# Altium project LANDING-STATIONnoCTRL.PrjPcb
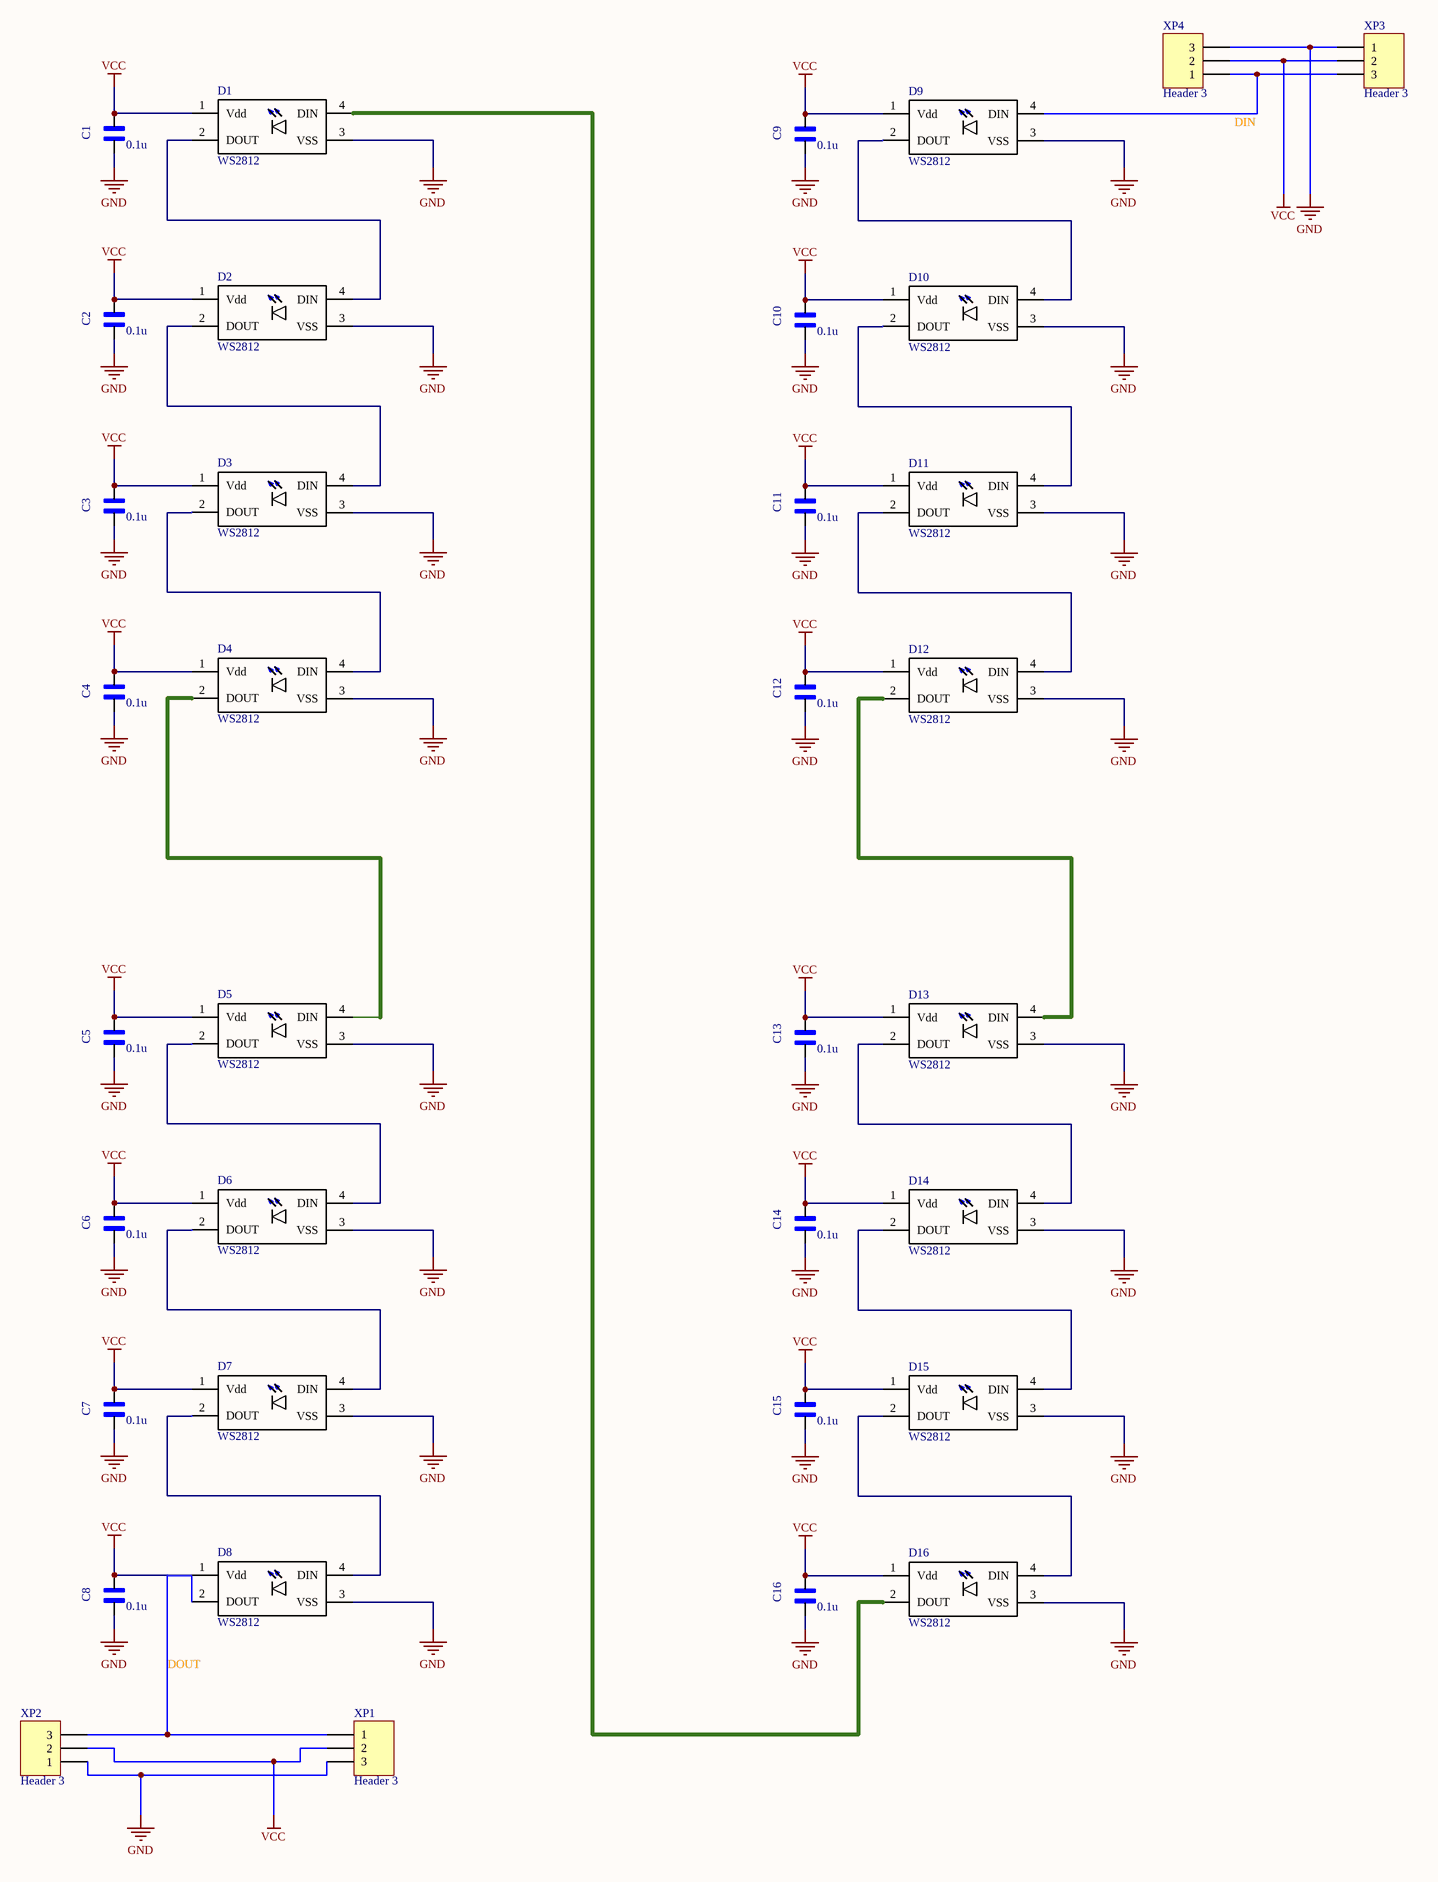
[diagram p0: LANDING-STATION-SCHnoCTRL.SchDoc]
Designer: Ehsan Shaghaei; Version: 1.0
1 sheet, 36 parts. Net scope: global (net labels, ports and power ports of the same name join across sheets).
Board file: LANDING-STATION-PCBnoCTRL.PcbDoc

## Sheet LANDING-STATION-SCHnoCTRL.SchDoc
size D; Author: Ehsan Shaghaei; CompanyName: Innopolis; Engineer: Ehsan Shaghaei; Organization: Innopolis Unmanned Tech. Labs; SheetNumber: 1; SheetTotal: 1

### Parts
C1  value 0.1u  [*CAPC1608X90]  (hidden comment: GX035C104MAT2-500)
C2  value 0.1u  [*CAPC1608X90]  (hidden comment: GX035C104MAT2-500)
C3  value 0.1u  [*CAPC1608X90]  (hidden comment: GX035C104MAT2-500)
C4  value 0.1u  [*CAPC1608X90]  (hidden comment: GX035C104MAT2-500)
C5  value 0.1u  [*CAPC1608X90]  (hidden comment: GX035C104MAT2-500)
C6  value 0.1u  [*CAPC1608X90]  (hidden comment: GX035C104MAT2-500)
C7  value 0.1u  [*CAPC1608X90]  (hidden comment: GX035C104MAT2-500)
C8  value 0.1u  [*CAPC1608X90]  (hidden comment: GX035C104MAT2-500)
C9  value 0.1u  [*CAPC1608X90]  (hidden comment: GX035C104MAT2-500)
C10  value 0.1u  [*CAPC1608X90]  (hidden comment: GX035C104MAT2-500)
C11  value 0.1u  [*CAPC1608X90]  (hidden comment: GX035C104MAT2-500)
C12  value 0.1u  [*CAPC1608X90]  (hidden comment: GX035C104MAT2-500)
C13  value 0.1u  [*CAPC1608X90]  (hidden comment: GX035C104MAT2-500)
C14  value 0.1u  [*CAPC1608X90]  (hidden comment: GX035C104MAT2-500)
C15  value 0.1u  [*CAPC1608X90]  (hidden comment: GX035C104MAT2-500)
C16  value 0.1u  [*CAPC1608X90]  (hidden comment: GX035C104MAT2-500)
D1  WS2812  [LED_WS2812]
D2  WS2812  [LED_WS2812]
D3  WS2812  [LED_WS2812]
D4  WS2812  [LED_WS2812]
D5  WS2812  [LED_WS2812]
D6  WS2812  [LED_WS2812]
D7  WS2812  [LED_WS2812]
D8  WS2812  [LED_WS2812]
D9  WS2812  [LED_WS2812]
D10  WS2812  [LED_WS2812]
D11  WS2812  [LED_WS2812]
D12  WS2812  [LED_WS2812]
D13  WS2812  [LED_WS2812]
D14  WS2812  [LED_WS2812]
D15  WS2812  [LED_WS2812]
D16  WS2812  [LED_WS2812]
XP1  Header 3  [HDR Side 3 pin]
XP2  Header 3  [HDR Side 3 pin]
XP3  Header 3  [HDR Side 3 pin]
XP4  Header 3  [HDR Side 3 pin]

### Nets
GND: C1.2 C2.2 C3.2 C4.2 C5.2 C6.2 C7.2 C8.2 C9.2 C10.2 C11.2 C12.2 C13.2 C14.2 C15.2 C16.2 D1.3(VSS) D2.3(VSS) D3.3(VSS) D4.3(VSS) D5.3(VSS) D6.3(VSS) D7.3(VSS) D8.3(VSS) D9.3(VSS) D10.3(VSS) D11.3(VSS) D12.3(VSS) D13.3(VSS) D14.3(VSS) D15.3(VSS) D16.3(VSS) XP1.3 XP2.1 XP3.1 XP4.3
VCC: C1.1 C2.1 C3.1 C4.1 C5.1 C6.1 C7.1 C8.1 C9.1 C10.1 C11.1 C12.1 C13.1 C14.1 C15.1 C16.1 D1.1(Vdd) D2.1(Vdd) D3.1(Vdd) D4.1(Vdd) D5.1(Vdd) D6.1(Vdd) D7.1(Vdd) D8.1(Vdd) D9.1(Vdd) D10.1(Vdd) D11.1(Vdd) D12.1(Vdd) D13.1(Vdd) D14.1(Vdd) D15.1(Vdd) D16.1(Vdd) XP1.2 XP2.2 XP3.2 XP4.2
DIN: D9.4(DIN) XP3.3 XP4.1
DOUT: D8.2(DOUT) XP1.1 XP2.3
NetD1_2: D1.2(DOUT) D2.4(DIN)
NetD1_4: D1.4(DIN) D16.2(DOUT)
NetD2_2: D2.2(DOUT) D3.4(DIN)
NetD3_2: D3.2(DOUT) D4.4(DIN)
NetD4_2: D4.2(DOUT) D5.4(DIN)
NetD5_2: D5.2(DOUT) D6.4(DIN)
NetD6_2: D6.2(DOUT) D7.4(DIN)
NetD7_2: D7.2(DOUT) D8.4(DIN)
NetD9_2: D9.2(DOUT) D10.4(DIN)
NetD10_2: D10.2(DOUT) D11.4(DIN)
NetD11_2: D11.2(DOUT) D12.4(DIN)
NetD12_2: D12.2(DOUT) D13.4(DIN)
NetD13_2: D13.2(DOUT) D14.4(DIN)
NetD14_2: D14.2(DOUT) D15.4(DIN)
NetD15_2: D15.2(DOUT) D16.4(DIN)

### Library data of the parts
C1-C16 = GX035C104MAT2-500: Cap Thin Film 0.1uf 50v 0603; MF: AVX; MP: GX035C104MAT2-500 or CL10B104JB8NNNC; Pacage Metric: 1608; Type: SMD; Package: 0603 AVX; SnapEDA_Link: https://www.snapeda.com/parts/GX035C104MAT2-500/AVX/view-part/?ref=snap
D1-D16 = WS2812: Addressable Lighting - 5 LED Discrete Serial _Shift Register_ Red, Green, Blue _RGB_ 5.00mm Dia; MF: SparkFun Electronics; Availability: Unavailable; MP: WS2812; Price: None; Value: *; SnapEDA_Link: https://www.snapeda.com/parts/WS2812/SparkFun%20Electronics/view-part/106391/?ref=snap; Package: SparkFun Electronics; HelpURL: https://static.chipdip.ru/lib/554/DOC001554925.pdf; ChipDip_Link: https://www.chipdip.ru/product/ws2812b
XP1-XP4 = Header 3: Header, 3-Pin; LatestRevisionDate: 17-Jul-2002; LatestRevisionNote: Re-released for DXP Platform.; Publisher: Altium Limited